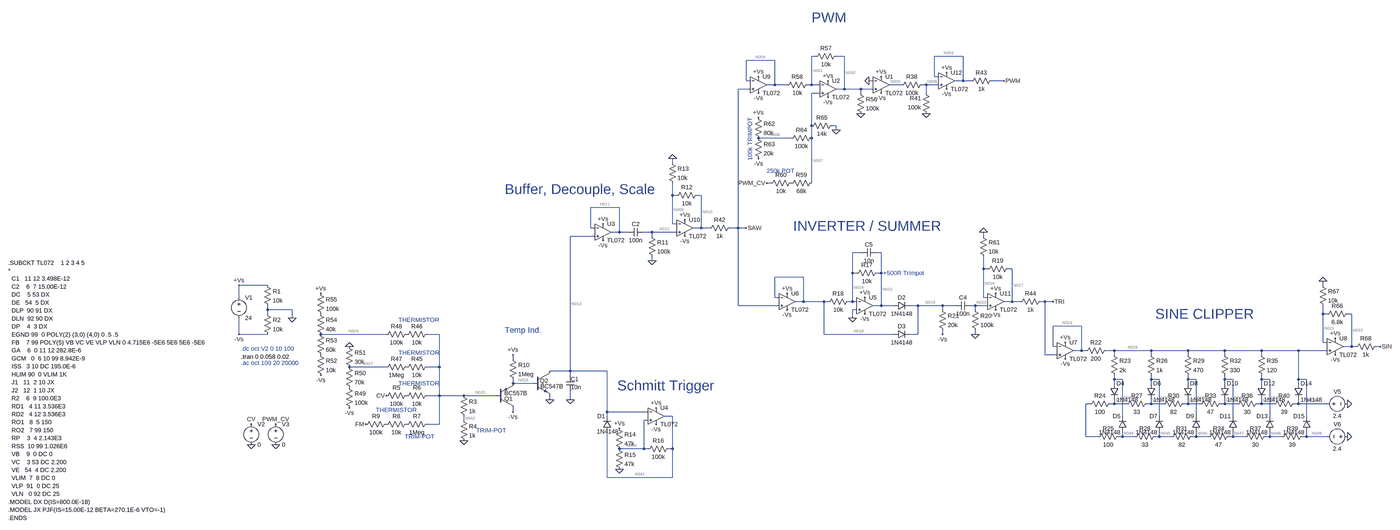
[diagram p0: schematic vco.asc, whole sheet]
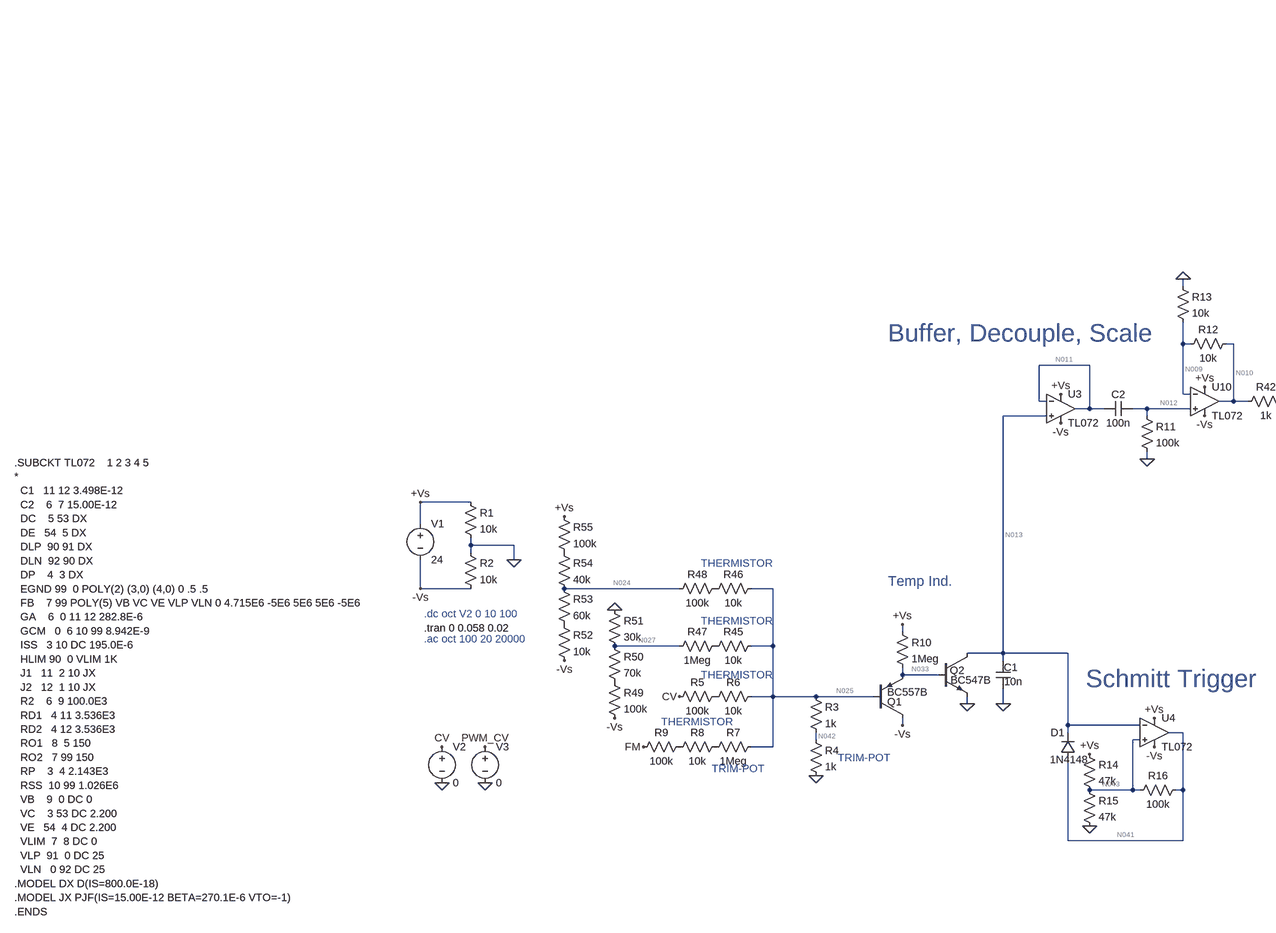
[diagram p1: schematic vco.asc, part, row 1 of 1, column 1 of 2]
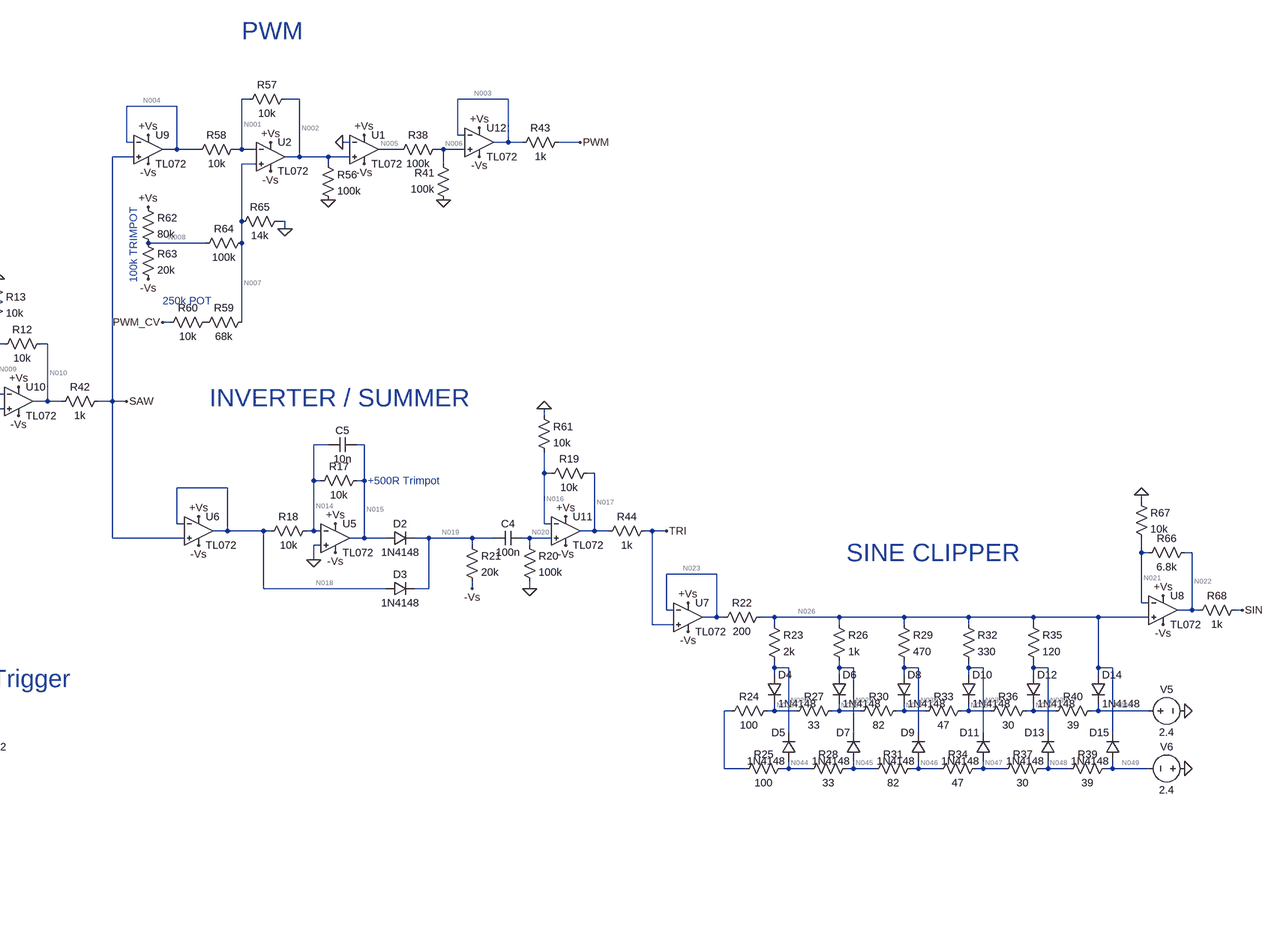
[diagram p2: schematic vco.asc, part, row 1 of 1, column 2 of 2]
vco.asc, the LTspice schematic file:
Version 4
SHEET 1 4188 1152
WIRE 1600 -1280 1584 -1280
WIRE 1712 -1280 1680 -1280
WIRE 2176 -1280 2064 -1280
WIRE 1440 -1264 1328 -1264
WIRE 2064 -1200 2064 -1280
WIRE 2080 -1200 2064 -1200
WIRE 1328 -1184 1328 -1264
WIRE 1344 -1184 1328 -1184
WIRE 1824 -1184 1808 -1184
WIRE 2176 -1184 2176 -1280
WIRE 2176 -1184 2144 -1184
WIRE 2208 -1184 2176 -1184
WIRE 2336 -1184 2288 -1184
WIRE 1440 -1168 1440 -1264
WIRE 1440 -1168 1408 -1168
WIRE 1488 -1168 1440 -1168
WIRE 1584 -1168 1584 -1280
WIRE 1584 -1168 1568 -1168
WIRE 1616 -1168 1584 -1168
WIRE 1936 -1168 1888 -1168
WIRE 2032 -1168 2016 -1168
WIRE 2080 -1168 2032 -1168
WIRE 1344 -1152 1296 -1152
WIRE 1712 -1152 1712 -1280
WIRE 1712 -1152 1680 -1152
WIRE 1776 -1152 1712 -1152
WIRE 1824 -1152 1776 -1152
WIRE 1616 -1136 1584 -1136
WIRE 1776 -1136 1776 -1152
WIRE 2032 -1136 2032 -1168
WIRE 1584 -1008 1584 -1136
WIRE 1680 -1008 1664 -1008
WIRE 1680 -992 1680 -1008
WIRE 1504 -960 1376 -960
WIRE 1584 -960 1584 -1008
WIRE 1040 -864 1040 -880
WIRE 1424 -784 1408 -784
WIRE 1584 -784 1584 -960
WIRE 1040 -736 1040 -784
WIRE 1056 -736 1040 -736
WIRE 1152 -736 1136 -736
WIRE 832 -688 720 -688
WIRE 1040 -624 1040 -736
WIRE 1056 -624 1040 -624
WIRE 720 -608 720 -688
WIRE 736 -608 720 -608
WIRE 1152 -608 1152 -736
WIRE 1152 -608 1120 -608
WIRE 1184 -608 1152 -608
WIRE 1296 -608 1296 -1152
WIRE 1296 -608 1264 -608
WIRE 1328 -608 1296 -608
WIRE 832 -592 832 -688
WIRE 832 -592 800 -592
WIRE 864 -592 832 -592
WIRE 960 -592 928 -592
WIRE 1056 -592 960 -592
WIRE 736 -576 640 -576
WIRE 960 -576 960 -592
WIRE 2256 -576 2256 -592
WIRE 1776 -512 1744 -512
WIRE 1856 -512 1840 -512
WIRE 960 -480 960 -496
WIRE 2256 -448 2256 -496
WIRE 2272 -448 2256 -448
WIRE 2368 -448 2352 -448
WIRE 1744 -432 1744 -512
WIRE 1760 -432 1744 -432
WIRE 1856 -432 1856 -512
WIRE 1856 -432 1840 -432
WIRE 1552 -416 1440 -416
WIRE -544 -384 -656 -384
WIRE 3584 -384 3584 -400
WIRE -656 -336 -656 -384
WIRE 1440 -336 1440 -416
WIRE 1456 -336 1440 -336
WIRE 2256 -336 2256 -448
WIRE 2272 -336 2256 -336
WIRE 1552 -320 1552 -416
WIRE 1552 -320 1520 -320
WIRE 1632 -320 1552 -320
WIRE 1648 -320 1632 -320
WIRE 1744 -320 1744 -432
WIRE 1744 -320 1728 -320
WIRE 1760 -320 1744 -320
WIRE 2368 -320 2368 -448
WIRE 2368 -320 2336 -320
WIRE 2400 -320 2368 -320
WIRE 2496 -320 2480 -320
WIRE 2528 -320 2496 -320
WIRE 1296 -304 1296 -608
WIRE 1456 -304 1296 -304
WIRE 1856 -304 1856 -432
WIRE 1856 -304 1824 -304
WIRE 1904 -304 1856 -304
WIRE 2000 -304 1968 -304
WIRE 2096 -304 2000 -304
WIRE 2144 -304 2096 -304
WIRE 2224 -304 2208 -304
WIRE 2272 -304 2224 -304
WIRE -544 -288 -544 -304
WIRE -448 -288 -544 -288
WIRE 1760 -288 1744 -288
WIRE 2096 -288 2096 -304
WIRE 2224 -288 2224 -304
WIRE -544 -272 -544 -288
WIRE 3584 -272 3584 -304
WIRE 3600 -272 3584 -272
WIRE 3696 -272 3680 -272
WIRE -448 -256 -448 -288
WIRE 1744 -256 1744 -288
WIRE 2640 -224 2528 -224
WIRE -656 -192 -656 -256
WIRE -544 -192 -656 -192
WIRE -80 -192 -336 -192
WIRE 128 -192 80 -192
WIRE 1632 -192 1632 -320
WIRE 1904 -192 1632 -192
WIRE 2000 -192 2000 -304
WIRE 2000 -192 1968 -192
WIRE 2096 -192 2096 -208
WIRE 2224 -192 2224 -208
WIRE 3584 -160 3584 -272
WIRE 3600 -160 3584 -160
WIRE 2528 -144 2528 -224
WIRE 2544 -144 2528 -144
WIRE 3696 -144 3696 -272
WIRE 3696 -144 3664 -144
WIRE 3712 -144 3696 -144
WIRE 3808 -144 3792 -144
WIRE 2640 -128 2640 -224
WIRE 2640 -128 2608 -128
WIRE 2656 -128 2640 -128
WIRE 2768 -128 2736 -128
WIRE 2912 -128 2768 -128
WIRE 3056 -128 2912 -128
WIRE 3200 -128 3056 -128
WIRE 3344 -128 3200 -128
WIRE 3488 -128 3344 -128
WIRE 3600 -128 3488 -128
WIRE 2496 -112 2496 -320
WIRE 2544 -112 2496 -112
WIRE 2768 -112 2768 -128
WIRE 2912 -112 2912 -128
WIRE 3056 -112 3056 -128
WIRE 3200 -112 3200 -128
WIRE 3344 -112 3344 -128
WIRE 416 -96 416 -112
WIRE -80 -64 -224 -64
WIRE 128 -64 128 -192
WIRE 128 -64 80 -64
WIRE 640 -48 640 -576
WIRE 640 -48 560 -48
WIRE 784 -48 640 -48
WIRE 640 -32 640 -48
WIRE 2768 -16 2768 -32
WIRE 2800 -16 2768 -16
WIRE 2912 -16 2912 -32
WIRE 2944 -16 2912 -16
WIRE 3056 -16 3056 -32
WIRE 3088 -16 3056 -16
WIRE 3200 -16 3200 -32
WIRE 3232 -16 3200 -16
WIRE 3344 -16 3344 -32
WIRE 3376 -16 3344 -16
WIRE 3488 -16 3488 -128
WIRE 3520 -16 3488 -16
WIRE 416 0 416 -16
WIRE 496 0 416 0
WIRE 2768 0 2768 -16
WIRE 2912 0 2912 -16
WIRE 3056 0 3056 -16
WIRE 3200 0 3200 -16
WIRE 3344 0 3344 -16
WIRE 3488 0 3488 -16
WIRE 128 48 128 -64
WIRE 128 48 80 48
WIRE 224 48 128 48
WIRE 352 48 224 48
WIRE 560 64 560 48
WIRE 640 64 640 32
WIRE 2672 80 2656 80
WIRE 2768 80 2768 64
WIRE 2768 80 2752 80
WIRE 2816 80 2768 80
WIRE 2912 80 2912 64
WIRE 2912 80 2896 80
WIRE 2960 80 2912 80
WIRE 3056 80 3056 64
WIRE 3056 80 3040 80
WIRE 3104 80 3056 80
WIRE 3200 80 3200 64
WIRE 3200 80 3184 80
WIRE 3248 80 3200 80
WIRE 3344 80 3344 64
WIRE 3344 80 3328 80
WIRE 3392 80 3344 80
WIRE 3488 80 3488 64
WIRE 3488 80 3472 80
WIRE 3600 80 3488 80
WIRE 416 112 416 96
WIRE 784 112 784 -48
WIRE 944 112 784 112
WIRE 784 128 784 112
WIRE 1040 128 1008 128
WIRE 2800 128 2800 -16
WIRE 2944 128 2944 -16
WIRE 3088 128 3088 -16
WIRE 3232 128 3232 -16
WIRE 3376 128 3376 -16
WIRE 3520 128 3520 -16
WIRE 224 144 224 128
WIRE 944 144 928 144
WIRE 128 160 128 48
WIRE 128 160 80 160
WIRE 2656 208 2656 80
WIRE 2704 208 2656 208
WIRE 2800 208 2800 192
WIRE 2800 208 2784 208
WIRE 2848 208 2800 208
WIRE 2944 208 2944 192
WIRE 2944 208 2928 208
WIRE 2992 208 2944 208
WIRE 3088 208 3088 192
WIRE 3088 208 3072 208
WIRE 3136 208 3088 208
WIRE 3232 208 3232 192
WIRE 3232 208 3216 208
WIRE 3280 208 3232 208
WIRE 3376 208 3376 192
WIRE 3376 208 3360 208
WIRE 3424 208 3376 208
WIRE 3520 208 3520 192
WIRE 3520 208 3504 208
WIRE 3600 208 3520 208
WIRE 928 256 928 144
WIRE 928 256 832 256
WIRE 944 256 928 256
WIRE 1040 256 1040 128
WIRE 1040 256 1024 256
WIRE 784 368 784 192
WIRE 1040 368 1040 256
WIRE 1040 368 784 368
FLAG -656 -384 +Vs
FLAG -656 -192 -Vs
FLAG -448 -256 0
FLAG -608 240 0
FLAG -608 160 CV
FLAG 416 -112 +Vs
FLAG 560 64 0
FLAG 416 112 -Vs
FLAG 640 64 0
FLAG 1328 -608 SAW
FLAG 960 -480 0
FLAG 768 -624 +Vs
FLAG 768 -560 -Vs
FLAG 832 176 +Vs
FLAG 832 336 0
FLAG 976 160 -Vs
FLAG 976 96 +Vs
FLAG 1792 -336 +Vs
FLAG 1792 -272 -Vs
FLAG 2528 -320 TRI
FLAG 1488 -352 +Vs
FLAG 1488 -288 -Vs
FLAG 2224 -192 0
FLAG 2096 -192 -Vs
FLAG 2576 -160 +Vs
FLAG 2576 -96 -Vs
FLAG 3808 -144 SIN
FLAG 3680 208 0
FLAG 3680 80 0
FLAG 3632 -176 +Vs
FLAG 3632 -112 -Vs
FLAG 224 224 0
FLAG -80 48 CV
FLAG -160 160 FM
FLAG -224 96 -Vs
FLAG -224 -144 0
FLAG -336 -32 -Vs
FLAG -336 -352 +Vs
FLAG 1856 -1136 -Vs
FLAG 1856 -1200 +Vs
FLAG 2336 -1184 PWM
FLAG 1808 -1184 0
FLAG 1776 -1056 0
FLAG 1648 -1184 +Vs
FLAG 1648 -1120 -Vs
FLAG 1408 -784 PWM_CV
FLAG 1376 -1200 +Vs
FLAG 1376 -1136 -Vs
FLAG -512 240 0
FLAG -512 160 PWM_CV
FLAG 1088 -640 +Vs
FLAG 1088 -576 -Vs
FLAG 1040 -880 0
FLAG 2304 -352 +Vs
FLAG 2304 -288 -Vs
FLAG 2256 -592 0
FLAG 2032 -1056 0
FLAG 2112 -1216 +Vs
FLAG 2112 -1152 -Vs
FLAG 1744 -256 0
FLAG 1376 -880 -Vs
FLAG 1376 -1040 +Vs
FLAG 1680 -992 0
FLAG 3584 -400 0
SYMBOL voltage -656 -352 R0
WINDOW 123 0 0 Left 0
SYMATTR SpiceLine Rser=1 Cpar=1n
SYMATTR InstName V1
SYMATTR Value 24
SYMBOL res -560 -400 R0
SYMATTR InstName R1
SYMATTR Value 10k
SYMBOL res -560 -288 R0
SYMATTR InstName R2
SYMATTR Value 10k
SYMBOL voltage -608 144 R0
WINDOW 123 0 0 Left 0
WINDOW 39 0 0 Left 0
SYMATTR InstName V2
SYMATTR Value 0
SYMBOL pnp 352 96 M180
WINDOW 0 30 36 Left 2
WINDOW 3 30 58 Left 2
SYMATTR InstName Q1
SYMATTR Value BC557B
SYMBOL npn 496 -48 R0
WINDOW 0 25 38 Left 2
WINDOW 3 27 60 Left 2
SYMATTR InstName Q2
SYMATTR Value BC547B
SYMBOL cap 624 -32 R0
WINDOW 0 17 15 Left 2
WINDOW 3 18 47 Left 2
SYMATTR InstName C1
SYMATTR Value 10n
SYMBOL res 400 -112 R0
SYMATTR InstName R10
SYMATTR Value 1Meg
SYMBOL diode 800 192 R180
WINDOW 0 24 64 Left 2
WINDOW 3 -29 4 Left 2
SYMATTR InstName D1
SYMATTR Value 1N4148
SYMBOL OpAmps\\opamp2 768 -656 R0
SYMATTR InstName U3
SYMATTR Value TL072
SYMBOL cap 928 -608 R90
WINDOW 0 0 32 VBottom 2
WINDOW 3 32 32 VTop 2
SYMATTR InstName C2
SYMATTR Value 100n
SYMBOL res 944 -592 R0
SYMATTR InstName R11
SYMATTR Value 100k
SYMBOL OpAmps\\opamp2 976 64 R0
SYMATTR InstName U4
SYMATTR Value TL072
SYMBOL res 816 160 R0
SYMATTR InstName R14
SYMATTR Value 47k
SYMBOL res 816 240 R0
SYMATTR InstName R15
SYMATTR Value 47k
SYMBOL res 1040 240 R90
WINDOW 0 0 56 VBottom 2
WINDOW 3 32 56 VTop 2
SYMATTR InstName R16
SYMATTR Value 100k
SYMBOL OpAmps\\opamp2 1792 -368 R0
SYMATTR InstName U5
SYMATTR Value TL072
SYMBOL res 1856 -448 R90
WINDOW 0 0 56 VBottom 2
WINDOW 3 32 56 VTop 2
SYMATTR InstName R17
SYMATTR Value 10k
SYMBOL res 1744 -336 R90
WINDOW 0 0 56 VBottom 2
WINDOW 3 32 56 VTop 2
SYMATTR InstName R18
SYMATTR Value 10k
SYMBOL diode 1904 -288 R270
WINDOW 0 32 32 VTop 2
WINDOW 3 0 32 VBottom 2
SYMATTR InstName D2
SYMATTR Value 1N4148
SYMBOL diode 1904 -176 R270
WINDOW 0 32 32 VTop 2
WINDOW 3 0 32 VBottom 2
SYMATTR InstName D3
SYMATTR Value 1N4148
SYMBOL OpAmps\\opamp2 1488 -384 R0
SYMATTR InstName U6
SYMATTR Value TL072
SYMBOL cap 2208 -320 R90
WINDOW 0 0 32 VBottom 2
WINDOW 3 32 32 VTop 2
SYMATTR InstName C4
SYMATTR Value 100n
SYMBOL res 2208 -304 R0
SYMATTR InstName R20
SYMATTR Value 100k
SYMBOL res 2080 -304 R0
SYMATTR InstName R21
SYMATTR Value 20k
SYMBOL OpAmps\\opamp2 2576 -192 R0
SYMATTR InstName U7
SYMATTR Value TL072
SYMBOL res 2752 -144 R90
WINDOW 0 0 56 VBottom 2
WINDOW 3 32 56 VTop 2
SYMATTR InstName R22
SYMATTR Value 200
SYMBOL res 2752 -128 R0
SYMATTR InstName R23
SYMATTR Value 2k
SYMBOL diode 2752 0 R0
SYMATTR InstName D4
SYMATTR Value 1N4148
SYMBOL res 2768 64 R90
WINDOW 0 0 56 VBottom 2
WINDOW 3 32 56 VTop 2
SYMATTR InstName R24
SYMATTR Value 100
SYMBOL res 2800 192 R90
WINDOW 0 0 56 VBottom 2
WINDOW 3 32 56 VTop 2
SYMATTR InstName R25
SYMATTR Value 100
SYMBOL diode 2816 192 R180
WINDOW 0 24 64 Left 2
WINDOW 3 24 0 Left 2
SYMATTR InstName D5
SYMATTR Value 1N4148
SYMBOL res 2896 -128 R0
SYMATTR InstName R26
SYMATTR Value 1k
SYMBOL diode 2896 0 R0
SYMATTR InstName D6
SYMATTR Value 1N4148
SYMBOL res 2912 64 R90
WINDOW 0 0 56 VBottom 2
WINDOW 3 32 56 VTop 2
SYMATTR InstName R27
SYMATTR Value 33
SYMBOL res 2944 192 R90
WINDOW 0 0 56 VBottom 2
WINDOW 3 32 56 VTop 2
SYMATTR InstName R28
SYMATTR Value 33
SYMBOL diode 2960 192 R180
WINDOW 0 24 64 Left 2
WINDOW 3 24 0 Left 2
SYMATTR InstName D7
SYMATTR Value 1N4148
SYMBOL res 3040 -128 R0
SYMATTR InstName R29
SYMATTR Value 470
SYMBOL diode 3040 0 R0
SYMATTR InstName D8
SYMATTR Value 1N4148
SYMBOL res 3056 64 R90
WINDOW 0 0 56 VBottom 2
WINDOW 3 32 56 VTop 2
SYMATTR InstName R30
SYMATTR Value 82
SYMBOL res 3088 192 R90
WINDOW 0 0 56 VBottom 2
WINDOW 3 32 56 VTop 2
SYMATTR InstName R31
SYMATTR Value 82
SYMBOL diode 3104 192 R180
WINDOW 0 24 64 Left 2
WINDOW 3 24 0 Left 2
SYMATTR InstName D9
SYMATTR Value 1N4148
SYMBOL res 3184 -128 R0
SYMATTR InstName R32
SYMATTR Value 330
SYMBOL diode 3184 0 R0
SYMATTR InstName D10
SYMATTR Value 1N4148
SYMBOL res 3200 64 R90
WINDOW 0 0 56 VBottom 2
WINDOW 3 32 56 VTop 2
SYMATTR InstName R33
SYMATTR Value 47
SYMBOL res 3232 192 R90
WINDOW 0 0 56 VBottom 2
WINDOW 3 32 56 VTop 2
SYMATTR InstName R34
SYMATTR Value 47
SYMBOL diode 3248 192 R180
WINDOW 0 24 64 Left 2
WINDOW 3 24 0 Left 2
SYMATTR InstName D11
SYMATTR Value 1N4148
SYMBOL res 3328 -128 R0
SYMATTR InstName R35
SYMATTR Value 120
SYMBOL diode 3328 0 R0
SYMATTR InstName D12
SYMATTR Value 1N4148
SYMBOL res 3344 64 R90
WINDOW 0 0 56 VBottom 2
WINDOW 3 32 56 VTop 2
SYMATTR InstName R36
SYMATTR Value 30
SYMBOL res 3376 192 R90
WINDOW 0 0 56 VBottom 2
WINDOW 3 32 56 VTop 2
SYMATTR InstName R37
SYMATTR Value 30
SYMBOL diode 3392 192 R180
WINDOW 0 24 64 Left 2
WINDOW 3 24 0 Left 2
SYMATTR InstName D13
SYMATTR Value 1N4148
SYMBOL diode 3472 0 R0
SYMATTR InstName D14
SYMATTR Value 1N4148
SYMBOL res 3520 192 R90
WINDOW 0 0 56 VBottom 2
WINDOW 3 32 56 VTop 2
SYMATTR InstName R39
SYMATTR Value 39
SYMBOL diode 3536 192 R180
WINDOW 0 24 64 Left 2
WINDOW 3 24 0 Left 2
SYMATTR InstName D15
SYMATTR Value 1N4148
SYMBOL res 3488 64 R90
WINDOW 0 0 56 VBottom 2
WINDOW 3 32 56 VTop 2
SYMATTR InstName R40
SYMATTR Value 39
SYMBOL voltage 3584 80 R270
WINDOW 0 32 56 VTop 2
WINDOW 3 -32 56 VBottom 2
WINDOW 123 0 0 Left 0
WINDOW 39 0 0 Left 0
SYMATTR InstName V5
SYMATTR Value 2.4
SYMBOL voltage 3696 208 R90
WINDOW 0 -32 56 VBottom 2
WINDOW 3 32 56 VTop 2
WINDOW 123 0 0 Left 0
WINDOW 39 0 0 Left 0
SYMATTR InstName V6
SYMATTR Value 2.4
SYMBOL OpAmps\\opamp2 3632 -208 R0
SYMATTR InstName U8
SYMATTR Value TL072
SYMBOL res 208 32 R0
SYMATTR InstName R3
SYMATTR Value 1k
SYMBOL res 208 128 R0
SYMATTR InstName R4
SYMATTR Value 1k
SYMBOL res 16 32 R90
WINDOW 0 0 56 VBottom 2
WINDOW 3 32 56 VTop 2
SYMATTR InstName R5
SYMATTR Value 100k
SYMBOL res 96 32 R90
WINDOW 0 0 56 VBottom 2
WINDOW 3 32 56 VTop 2
SYMATTR InstName R6
SYMATTR Value 10k
SYMBOL res 96 144 R90
WINDOW 0 0 56 VBottom 2
WINDOW 3 32 56 VTop 2
SYMATTR InstName R7
SYMATTR Value 1Meg
SYMBOL res 16 144 R90
WINDOW 0 0 56 VBottom 2
WINDOW 3 32 56 VTop 2
SYMATTR InstName R8
SYMATTR Value 10k
SYMBOL res -64 144 R90
WINDOW 0 0 56 VBottom 2
WINDOW 3 32 56 VTop 2
SYMATTR InstName R9
SYMATTR Value 100k
SYMBOL res 96 -80 R90
WINDOW 0 0 56 VBottom 2
WINDOW 3 32 56 VTop 2
SYMATTR InstName R45
SYMATTR Value 10k
SYMBOL res 96 -208 R90
WINDOW 0 0 56 VBottom 2
WINDOW 3 32 56 VTop 2
SYMATTR InstName R46
SYMATTR Value 10k
SYMBOL res 16 -80 R90
WINDOW 0 0 56 VBottom 2
WINDOW 3 32 56 VTop 2
SYMATTR InstName R47
SYMATTR Value 1Meg
SYMBOL res 16 -208 R90
WINDOW 0 0 56 VBottom 2
WINDOW 3 32 56 VTop 2
SYMATTR InstName R48
SYMATTR Value 100k
SYMBOL res -240 0 R0
SYMATTR InstName R49
SYMATTR Value 100k
SYMBOL res -240 -80 R0
SYMATTR InstName R50
SYMATTR Value 70k
SYMBOL res -240 -160 R0
SYMATTR InstName R51
SYMATTR Value 30k
SYMBOL res -352 -128 R0
SYMATTR InstName R52
SYMATTR Value 10k
SYMBOL res -352 -208 R0
SYMATTR InstName R53
SYMATTR Value 60k
SYMBOL res -352 -288 R0
SYMATTR InstName R54
SYMATTR Value 40k
SYMBOL res -352 -368 R0
SYMATTR InstName R55
SYMATTR Value 100k
SYMBOL OpAmps\\opamp2 1856 -1232 R0
SYMATTR InstName U1
SYMATTR Value TL072
SYMBOL res 1760 -1152 R0
SYMATTR InstName R56
SYMATTR Value 100k
SYMBOL OpAmps\\opamp2 1648 -1216 R0
SYMATTR InstName U2
SYMATTR Value TL072
SYMBOL res 1696 -1296 R90
WINDOW 0 0 56 VBottom 2
WINDOW 3 32 56 VTop 2
SYMATTR InstName R57
SYMATTR Value 10k
SYMBOL res 1584 -1184 R90
WINDOW 0 0 56 VBottom 2
WINDOW 3 32 56 VTop 2
SYMATTR InstName R58
SYMATTR Value 10k
SYMBOL res 1488 -768 R270
WINDOW 0 32 56 VTop 2
WINDOW 3 0 56 VBottom 2
SYMATTR InstName R59
SYMATTR Value 68k
SYMBOL OpAmps\\opamp2 1376 -1232 R0
SYMATTR InstName U9
SYMATTR Value TL072
SYMBOL voltage -512 144 R0
WINDOW 123 0 0 Left 0
WINDOW 39 0 0 Left 0
SYMATTR InstName V3
SYMATTR Value 0
SYMBOL OpAmps\\opamp2 1088 -672 R0
SYMATTR InstName U10
SYMATTR Value TL072
SYMBOL res 1152 -752 R90
WINDOW 0 0 56 VBottom 2
WINDOW 3 32 56 VTop 2
SYMATTR InstName R12
SYMATTR Value 10k
SYMBOL res 1024 -880 R0
SYMATTR InstName R13
SYMATTR Value 10k
SYMBOL OpAmps\\opamp2 2304 -384 R0
SYMATTR InstName U11
SYMATTR Value TL072
SYMBOL res 2368 -464 R90
WINDOW 0 0 56 VBottom 2
WINDOW 3 32 56 VTop 2
SYMATTR InstName R19
SYMATTR Value 10k
SYMBOL res 2240 -592 R0
SYMATTR InstName R61
SYMATTR Value 10k
SYMBOL res 2032 -1184 R90
WINDOW 0 0 56 VBottom 2
WINDOW 3 32 56 VTop 2
SYMATTR InstName R38
SYMATTR Value 100k
SYMBOL res 2048 -1040 R180
WINDOW 0 36 76 Left 2
WINDOW 3 36 40 Left 2
SYMATTR InstName R41
SYMATTR Value 100k
SYMBOL OpAmps\\opamp2 2112 -1248 R0
SYMATTR InstName U12
SYMATTR Value TL072
SYMBOL res 1280 -624 R90
WINDOW 0 0 56 VBottom 2
WINDOW 3 32 56 VTop 2
SYMATTR InstName R42
SYMATTR Value 1k
SYMBOL cap 1840 -528 R90
WINDOW 0 0 32 VBottom 2
WINDOW 3 32 32 VTop 2
SYMATTR InstName C5
SYMATTR Value 10n
SYMBOL res 2304 -1200 R90
WINDOW 0 0 56 VBottom 2
WINDOW 3 32 56 VTop 2
SYMATTR InstName R43
SYMATTR Value 1k
SYMBOL res 2496 -336 R90
WINDOW 0 0 56 VBottom 2
WINDOW 3 32 56 VTop 2
SYMATTR InstName R44
SYMATTR Value 1k
SYMBOL res 1520 -800 R90
WINDOW 0 0 56 VBottom 2
WINDOW 3 32 56 VTop 2
SYMATTR InstName R60
SYMATTR Value 10k
SYMBOL res 1360 -1056 R0
SYMATTR InstName R62
SYMATTR Value 80k
SYMBOL res 1360 -976 R0
SYMATTR InstName R63
SYMATTR Value 20k
SYMBOL res 1600 -976 R90
WINDOW 0 0 56 VBottom 2
WINDOW 3 32 56 VTop 2
SYMATTR InstName R64
SYMATTR Value 100k
SYMBOL res 1680 -1024 R90
WINDOW 0 0 56 VBottom 2
WINDOW 3 32 56 VTop 2
SYMATTR InstName R65
SYMATTR Value 14k
SYMBOL res 3696 -288 R90
WINDOW 0 0 56 VBottom 2
WINDOW 3 32 56 VTop 2
SYMATTR InstName R66
SYMATTR Value 6.8k
SYMBOL res 3568 -400 R0
SYMATTR InstName R67
SYMATTR Value 10k
SYMBOL res 3808 -160 R90
WINDOW 0 0 56 VBottom 2
WINDOW 3 32 56 VTop 2
SYMATTR InstName R68
SYMATTR Value 1k
TEXT -2032 -472 Left 2 !.SUBCKT TL072    1 2 3 4 5\n*\n  C1   11 12 3.498E-12\n  C2    6  7 15.00E-12\n  DC    5 53 DX\n  DE   54  5 DX\n  DLP  90 91 DX\n  DLN  92 90 DX\n  DP    4  3 DX\n  EGND 99  0 POLY(2) (3,0) (4,0) 0 .5 .5\n  FB    7 99 POLY(5) VB VC VE VLP VLN 0 4.715E6 -5E6 5E6 5E6 -5E6\n  GA    6  0 11 12 282.8E-6\n  GCM   0  6 10 99 8.942E-9\n  ISS   3 10 DC 195.0E-6\n  HLIM 90  0 VLIM 1K\n  J1   11  2 10 JX\n  J2   12  1 10 JX\n  R2    6  9 100.0E3\n  RD1   4 11 3.536E3\n  RD2   4 12 3.536E3\n  RO1   8  5 150\n  RO2   7 99 150\n  RP    3  4 2.143E3\n  RSS  10 99 1.026E6\n  VB    9  0 DC 0\n  VC    3 53 DC 2.200\n  VE   54  4 DC 2.200\n  VLIM  7  8 DC 0\n  VLP  91  0 DC 25\n  VLN   0 92 DC 25\n.MODEL DX D(IS=800.0E-18)\n.MODEL JX PJF(IS=15.00E-12 BETA=270.1E-6 VTO=-1)\n.ENDS
TEXT -648 -104 Left 2 !.tran 0 0.058 0.02
TEXT -648 -80 Left 2 ;.ac oct 100 20 20000
TEXT -648 -136 Left 2 ;.dc oct V2 0 10 100
TEXT 824 8 Left 5 ;Schmitt Trigger
TEXT 384 -760 Left 5 ;Buffer, Decouple, Scale
TEXT 384 -208 Left 3 ;Temp Ind.
TEXT 1512 -616 Left 5 ;INVERTER / SUMMER
TEXT 272 184 Left 2 ;TRIM-POT
TEXT -32 0 Left 2 ;THERMISTOR
TEXT -120 104 Left 2 ;THERMISTOR
TEXT -8 208 Left 2 ;TRIM-POT
TEXT -32 -120 Left 2 ;THERMISTOR
TEXT -32 -248 Left 2 ;THERMISTOR
TEXT 1584 -1432 Left 5 ;PWM
TEXT 1864 -432 Left 2 ;+500R Trimpot
TEXT 1408 -832 Left 2 ;250k POT
TEXT 1344 -1040 VRight 2 ;100k TRIMPOT
TEXT 2928 -272 Left 5 ;SINE CLIPPER

The netlist it stands for:
* vco.asc
V1 +Vs -Vs 24 Rser=1 Cpar=1n
R1 +Vs 0 10k
R2 0 -Vs 10k
V2 CV 0 0
Q1 -Vs N025 N033 0 BC557B
Q2 N013 N033 0 0 BC547B
C1 N013 0 10n
R10 +Vs N033 1Meg
D1 N041 N013 1N4148
XU3 N013 N011 +Vs -Vs N011 TL072  ; pins In+ In- V+ V- OUT
C2 N012 N011 100n
R11 N012 0 100k
XU4 N043 N013 +Vs -Vs N041 TL072  ; pins In+ In- V+ V- OUT
R14 +Vs N043 47k
R15 N043 0 47k
R16 N041 N043 100k
XU5 0 N014 +Vs -Vs N015 TL072  ; pins In+ In- V+ V- OUT
R17 N015 N014 10k
R18 N014 N018 10k
D2 N015 N019 1N4148
D3 N018 N019 1N4148
XU6 SAW N018 +Vs -Vs N018 TL072  ; pins In+ In- V+ V- OUT
C4 N020 N019 100n
R20 N020 0 100k
R21 N019 -Vs 20k
XU7 TRI N023 +Vs -Vs N023 TL072  ; pins In+ In- V+ V- OUT
R22 N026 N023 200
R23 N026 N028 2k
D4 N028 N035 1N4148
R24 N035 N034 100
R25 N044 N034 100
D5 N044 N028 1N4148
R26 N026 N029 1k
D6 N029 N036 1N4148
R27 N036 N035 33
R28 N045 N044 33
D7 N045 N029 1N4148
R29 N026 N030 470
D8 N030 N037 1N4148
R30 N037 N036 82
R31 N046 N045 82
D9 N046 N030 1N4148
R32 N026 N031 330
D10 N031 N038 1N4148
R33 N038 N037 47
R34 N047 N046 47
D11 N047 N031 1N4148
R35 N026 N032 120
D12 N032 N039 1N4148
R36 N039 N038 30
R37 N048 N047 30
D13 N048 N032 1N4148
D14 N026 N040 1N4148
R39 N049 N048 39
D15 N049 N026 1N4148
R40 N040 N039 39
V5 N040 0 2.4
V6 0 N049 2.4
XU8 N026 N021 +Vs -Vs N022 TL072  ; pins In+ In- V+ V- OUT
R3 N025 N042 1k
R4 N042 0 1k
R5 P001 CV 100k
R6 N025 P001 10k
R7 N025 P002 1Meg
R8 P002 P003 10k
R9 P003 FM 100k
R45 N025 P004 10k
R46 N025 P005 10k
R47 P004 N027 1Meg
R48 P005 N024 100k
R49 P006 -Vs 100k
R50 N027 P006 70k
R51 0 N027 30k
R52 P007 -Vs 10k
R53 N024 P007 60k
R54 P008 N024 40k
R55 +Vs P008 100k
XU1 N002 0 +Vs -Vs N005 TL072  ; pins In+ In- V+ V- OUT
R56 N002 0 100k
XU2 N007 N001 +Vs -Vs N002 TL072  ; pins In+ In- V+ V- OUT
R57 N002 N001 10k
R58 N001 N004 10k
R59 P009 N007 68k
XU9 SAW N004 +Vs -Vs N004 TL072  ; pins In+ In- V+ V- OUT
V3 PWM_CV 0 0
XU10 N012 N009 +Vs -Vs N010 TL072  ; pins In+ In- V+ V- OUT
R12 N010 N009 10k
R13 0 N009 10k
XU11 N020 N016 +Vs -Vs N017 TL072  ; pins In+ In- V+ V- OUT
R19 N017 N016 10k
R61 0 N016 10k
R38 N006 N005 100k
R41 0 N006 100k
XU12 N006 N003 +Vs -Vs N003 TL072  ; pins In+ In- V+ V- OUT
R42 SAW N010 1k
C5 N015 N014 10n
R43 PWM N003 1k
R44 TRI N017 1k
R60 P009 PWM_CV 10k
R62 +Vs N008 80k
R63 N008 -Vs 20k
R64 N007 N008 100k
R65 0 N007 14k
R66 N022 N021 6.8k
R67 0 N021 10k
R68 SIN N022 1k
.model D D
.lib standard.dio
.model NPN NPN
.model PNP PNP
.lib standard.bjt
.SUBCKT TL072    1 2 3 4 5
*
  C1   11 12 3.498E-12
  C2    6  7 15.00E-12
  DC    5 53 DX
  DE   54  5 DX
  DLP  90 91 DX
  DLN  92 90 DX
  DP    4  3 DX
  EGND 99  0 POLY(2) (3,0) (4,0) 0 .5 .5
  FB    7 99 POLY(5) VB VC VE VLP VLN 0 4.715E6 -5E6 5E6 5E6 -5E6
  GA    6  0 11 12 282.8E-6
  GCM   0  6 10 99 8.942E-9
  ISS   3 10 DC 195.0E-6
  HLIM 90  0 VLIM 1K
  J1   11  2 10 JX
  J2   12  1 10 JX
  R2    6  9 100.0E3
  RD1   4 11 3.536E3
  RD2   4 12 3.536E3
  RO1   8  5 150
  RO2   7 99 150
  RP    3  4 2.143E3
  RSS  10 99 1.026E6
  VB    9  0 DC 0
  VC    3 53 DC 2.200
  VE   54  4 DC 2.200
  VLIM  7  8 DC 0
  VLP  91  0 DC 25
  VLN   0 92 DC 25
.MODEL DX D(IS=800.0E-18)
.MODEL JX PJF(IS=15.00E-12 BETA=270.1E-6 VTO=-1)
.ENDS
.tran 0 0.058 0.02
* .ac oct 100 20 20000
* .dc oct V2 0 10 100
* Schmitt Trigger
* Buffer, Decouple, Scale
* Temp Ind.
* INVERTER / SUMMER
* TRIM-POT
* THERMISTOR
* THERMISTOR
* TRIM-POT
* THERMISTOR
* THERMISTOR
* PWM
* +500R Trimpot
* 250k POT
* 100k TRIMPOT
* SINE CLIPPER
.backanno
.end

* Results of the author's LTspice run, read from the files saved beside the schematic
* Operating Point, zero values left out:
*   V(+vs) = 13.41 V
*   V(-vs) = -10.45 V
*   V(n025) = -33.74 mV
*   V(n033) = 468 mV
*   V(n013) = 6.774 V
*   V(n041) = 7.067 V
*   V(n011) = 6.774 V
*   V(n012) = -4.05 µV
*   V(n043) = 6.774 V
*   V(n015) = -50.02 µV
*   V(n014) = 57.56 µV
*   V(n018) = 165.5 µV
*   V(n019) = -521.1 mV
*   V(saw) = 108 µV
*   V(n020) = -4.05 µV
*   V(n023) = 165.9 µV
*   V(tri) = 108 µV
*   V(n026) = 165.9 µV
*   V(n028) = 165.9 µV
*   V(n035) = 725.1 mV
*   V(n044) = -725.1 mV
*   V(n029) = 165.9 µV
*   V(n036) = 964.3 mV
*   V(n045) = -964.3 mV
*   V(n030) = 165.9 µV
*   V(n037) = 1.559 V
*   V(n046) = -1.559 V
*   V(n031) = 165.9 µV
*   V(n038) = 1.9 V
*   V(n047) = -1.9 V
*   V(n032) = 165.9 µV
*   V(n039) = 2.117 V
*   V(n048) = -2.117 V
*   V(n040) = 2.4 V
*   V(n049) = -2.4 V
*   V(n022) = 376.2 µV
*   V(n021) = 223.8 µV
*   V(n042) = -16.87 mV
*   V(p001) = -30.67 mV
*   V(p002) = -33.74 mV
*   V(p003) = -33.74 mV
*   V(fm) = -33.74 mV
*   V(p004) = -48.55 mV
*   V(p005) = -191 mV
*   V(n027) = -1.53 V
*   V(n024) = -1.763 V
*   V(p006) = -5.203 V
*   V(p007) = -9.21 V
*   V(p008) = 2.572 V
*   V(n005) = -8.928 V
*   V(n002) = -1.054 V
*   V(n001) = -527.1 mV
*   V(n007) = -527.1 mV
*   V(n004) = 165.8 µV
*   V(p009) = -67.58 mV
*   V(n010) = 108.1 µV
*   V(n009) = 53.83 µV
*   V(n017) = 108.1 µV
*   V(n016) = 53.83 µV
*   V(n006) = -4.464 V
*   V(n003) = -4.464 V
*   V(pwm) = -4.464 V
*   V(n008) = -4.968 V
*   V(sin) = 376.2 µV
*   Ic(Q2) = 1.617 µA
*   Ib(Q2) = 5.519 nA
*   Ie(Q2) = -1.623 µA
*   Ic(Q1) = -12.91 µA
*   Ib(Q1) = -29.34 nA
*   Ie(Q1) = 12.94 µA
*   I(D15) = -2.522 nA
*   I(D14) = -2.522 nA
*   I(D13) = -2.522 nA
*   I(D12) = -2.522 nA
*   I(D11) = -2.522 nA
*   I(D10) = -2.522 nA
*   I(D9) = -2.522 nA
*   I(D8) = -2.522 nA
*   I(D7) = -2.521 nA
*   I(D6) = -2.521 nA
*   I(D5) = -2.521 nA
*   I(D4) = -2.521 nA
*   I(D3) = 248.8 µA
*   I(D2) = 247.7 µA
*   I(D1) = 1.617 µA
*   I(R67) = -22.38 nA
*   I(R66) = 22.42 nA
*   I(R65) = 37.65 µA
*   I(R64) = 44.41 µA
*   I(R63) = 274.2 µA
*   I(R62) = 229.7 µA
*   I(R60) = -6.758 µA
*   I(R44) = -40.5 pA
*   I(R42) = -81 pA
*   I(R41) = 44.64 µA
*   I(R38) = 44.64 µA
*   I(R61) = -5.383 nA
*   I(R19) = 5.423 nA
*   I(R13) = -5.383 nA
*   I(R12) = 5.423 nA
*   I(R59) = 6.758 µA
*   I(R58) = -52.72 µA
*   I(R57) = -52.72 µA
*   I(R56) = -10.54 µA
*   I(R55) = 108.4 µA
*   I(R54) = 108.4 µA
*   I(R53) = 124.1 µA
*   I(R52) = 124.1 µA
*   I(R51) = 51 µA
*   I(R50) = 52.48 µA
*   I(R49) = 52.48 µA
*   I(R48) = 15.72 µA
*   I(R47) = 1.481 µA
*   I(R46) = 15.72 µA
*   I(R45) = 1.481 µA
*   I(R6) = -306.7 nA
*   I(R5) = -306.7 nA
*   I(R4) = -16.87 µA
*   I(R3) = -16.87 µA
*   I(R40) = 7.251 mA
*   I(R39) = -7.251 mA
*   I(R37) = -7.251 mA
*   I(R36) = 7.251 mA
*   I(R34) = -7.251 mA
*   I(R33) = 7.251 mA
*   I(R31) = -7.251 mA
*   I(R30) = 7.251 mA
*   I(R28) = -7.251 mA
*   I(R27) = 7.251 mA
*   I(R25) = -7.251 mA
*   I(R24) = 7.251 mA
*   I(R22) = -40.5 pA
*   I(R21) = 496.5 µA
*   I(R20) = -40.5 pA
*   I(R18) = -10.8 nA
*   I(R17) = -10.76 nA
*   I(R16) = 2.928 µA
*   I(R15) = 144.1 µA
*   I(R14) = 141.2 µA
*   I(R11) = -40.5 pA
*   I(R10) = 12.94 µA
*   I(R2) = 1.045 mA
*   I(R1) = 1.341 mA
*   I(V3) = -6.758 µA
*   I(V6) = -7.251 mA
*   I(V5) = -7.251 mA
*   I(V2) = -306.7 nA
*   I(V1) = -137.8 mA
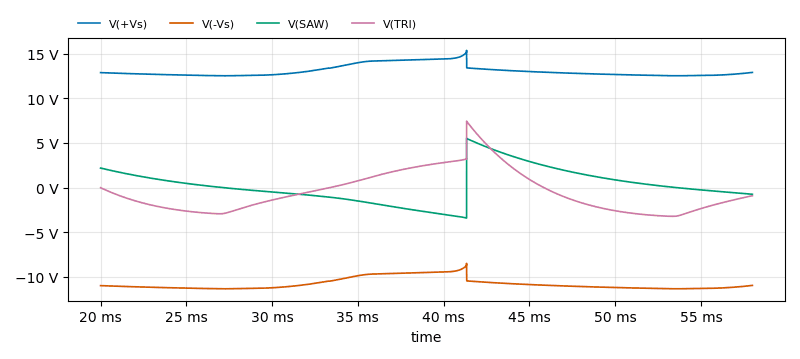
[diagram p3: Transient Analysis of vco.asc, plotted from the saved traces]
* Transient Analysis, 1 run:
*   V(+Vs): min 12.52 V, max 15.37 V, average 13.07 V, rms 13.08 V, last 12.9 V
*   V(-Vs): min -11.34 V, max -8.491 V, average -10.8 V, rms 10.82 V, last -10.96 V
*   V(SAW): min -3.419 V, max 5.506 V, average 245.1 mV, rms 1.904 V, last -747.6 mV
*   V(TRI): min -3.222 V, max 7.451 V, average -526.7 mV, rms 2.348 V, last -907.9 mV